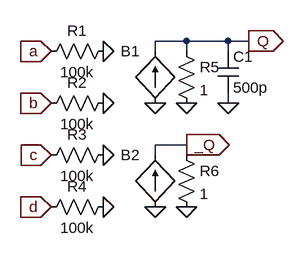
[diagram p0: schematic is_only_one-4len.asc]
is_only_one-4len.asc, the LTspice schematic file:
Version 4
SHEET 1 880 680
WIRE 192 80 144 80
WIRE 256 80 192 80
WIRE 288 80 256 80
WIRE 144 96 144 80
WIRE 192 96 192 80
WIRE 256 96 256 80
WIRE 256 176 256 160
WIRE 192 240 144 240
WIRE 144 256 144 240
WIRE 192 256 192 240
FLAG 288 80 Q
IOPIN 288 80 Out
FLAG 192 240 _Q
IOPIN 192 240 Out
FLAG -16 96 a
IOPIN -16 96 In
FLAG -16 176 b
IOPIN -16 176 In
FLAG -16 256 c
IOPIN -16 256 In
FLAG -16 336 d
IOPIN -16 336 In
FLAG 64 96 0
FLAG 64 336 0
FLAG 64 256 0
FLAG 64 176 0
FLAG 144 176 0
FLAG 192 176 0
FLAG 144 336 0
FLAG 192 336 0
FLAG 256 176 0
SYMBOL res 80 80 R90
WINDOW 0 0 56 VBottom 2
WINDOW 3 32 56 VTop 2
SYMATTR InstName R1
SYMATTR Value 100k
SYMBOL res 80 160 R90
WINDOW 0 0 56 VBottom 2
WINDOW 3 32 56 VTop 2
SYMATTR InstName R2
SYMATTR Value 100k
SYMBOL res 80 240 R90
WINDOW 0 0 56 VBottom 2
WINDOW 3 32 56 VTop 2
SYMATTR InstName R3
SYMATTR Value 100k
SYMBOL res 80 320 R90
WINDOW 0 0 56 VBottom 2
WINDOW 3 32 56 VTop 2
SYMATTR InstName R4
SYMATTR Value 100k
SYMBOL bi 144 176 R180
WINDOW 0 24 80 Left 2
WINDOW 3 24 0 Invisible 2
SYMATTR InstName B1
SYMATTR Value I=( !V(a)&!V(b) )&(V(c) ^ V(d)) + ( !V(c)&!V(d) )&(V(a) ^ V(b))
SYMBOL res 176 80 R0
SYMATTR InstName R5
SYMATTR Value 1
SYMBOL res 176 240 R0
SYMATTR InstName R6
SYMATTR Value 1
SYMBOL bi 144 336 R180
WINDOW 0 24 80 Left 2
WINDOW 3 24 0 Invisible 2
SYMATTR InstName B2
SYMATTR Value I=!I(B1)
SYMBOL cap 240 96 R0
SYMATTR InstName C1
SYMATTR Value 500p

The netlist it stands for:
* is_only_one-4len.asc
R1 0 a 100k
R2 0 b 100k
R3 0 c 100k
R4 0 d 100k
B1 0 Q I=( !V(a)&!V(b) )&(V(c) ^ V(d)) + ( !V(c)&!V(d) )&(V(a) ^ V(b))
R5 Q 0 1
R6 _Q 0 1
B2 0 _Q I=!I(B1)
C1 Q 0 500p
.backanno
.end